# EAGLE schematic kytkentäkaavio (EAGLE 9.7.0)
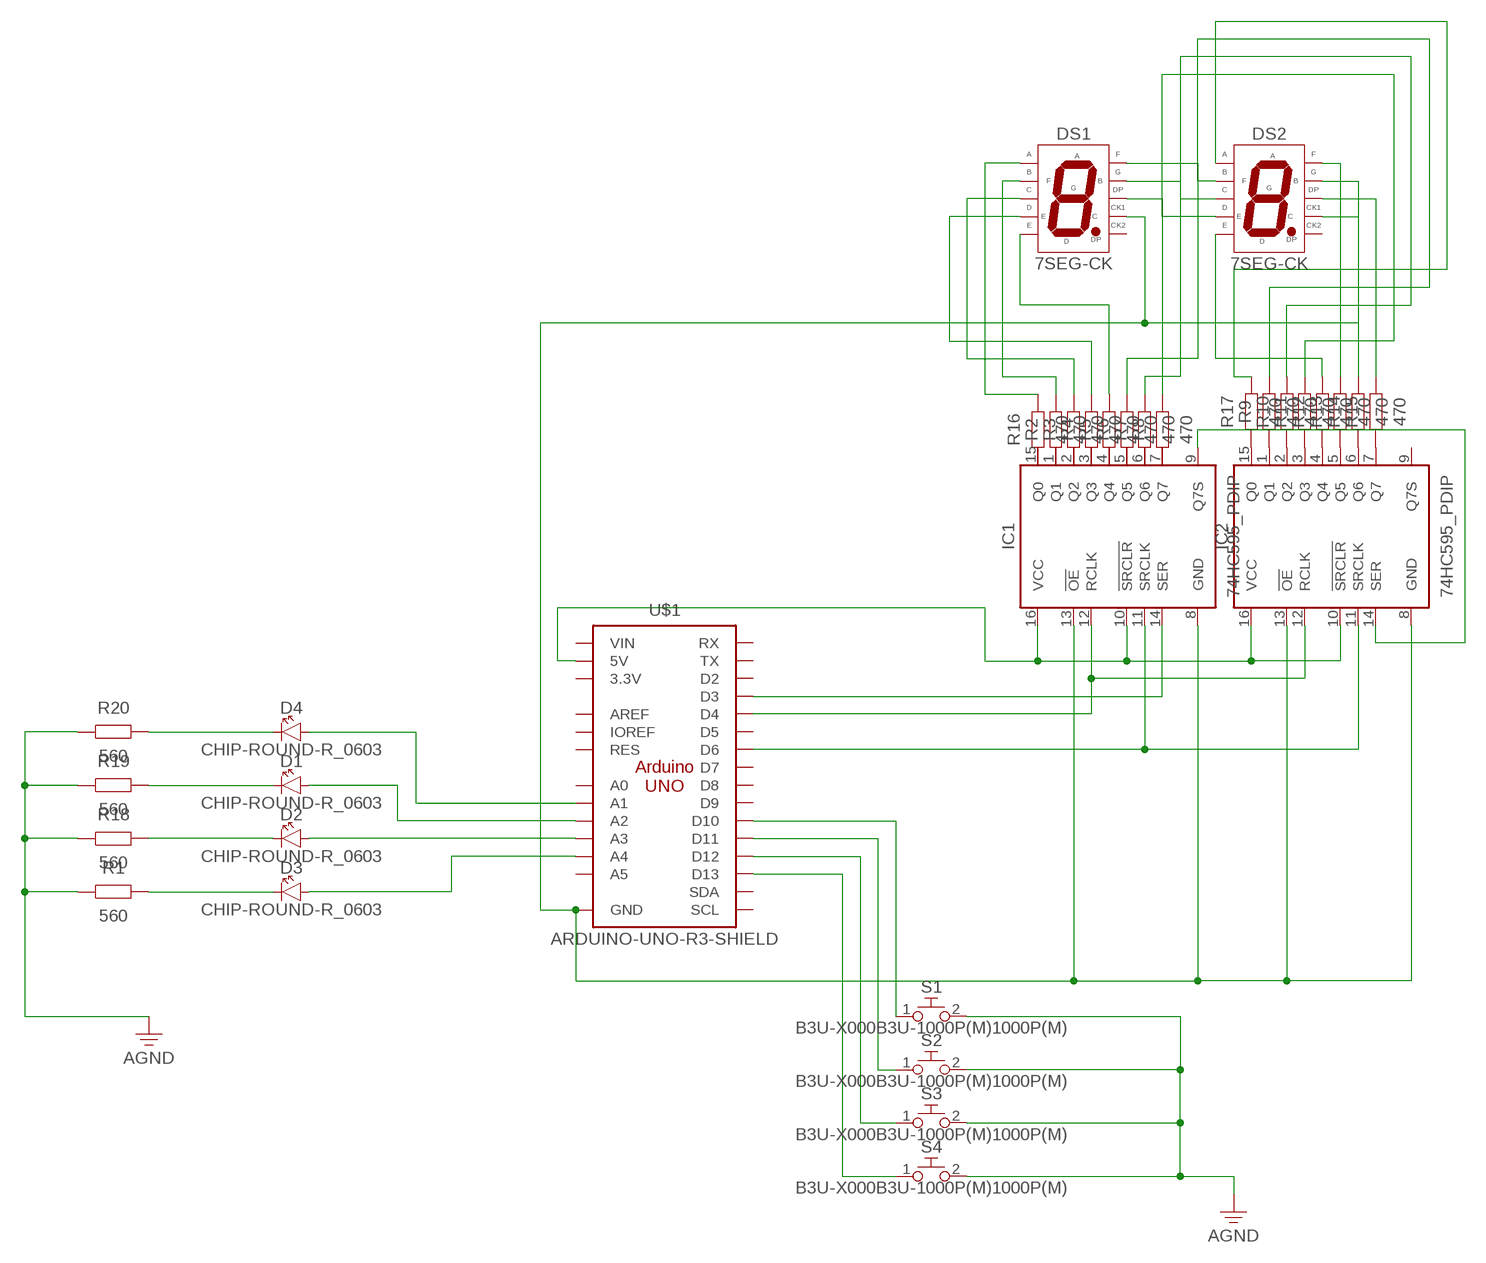
[diagram p0: schematic, sheet 1]

## Parts
D1  CHIP-ROUND-R_0603  [LEDC1608X65N_RND-R]
D2  CHIP-ROUND-R_0603  [LEDC1608X65N_RND-R]
D3  CHIP-ROUND-R_0603  [LEDC1608X65N_RND-R]
D4  CHIP-ROUND-R_0603  [LEDC1608X65N_RND-R]
DS1  7SEG-CK  [7SEG-13]
DS2  7SEG-CK  [7SEG-13]
IC1  74HC595_PDIP  [DIP762W53P254L1969H508Q16B]
IC2  74HC595_PDIP  [DIP762W53P254L1969H508Q16B]
R1  560  R_CHIP-0402(1005-METRIC)  [RESC1005X40]
R2  470  R_CHIP-0402(1005-METRIC)  [RESC1005X40]
R3  470  R_CHIP-0402(1005-METRIC)  [RESC1005X40]
R4  470  R_CHIP-0402(1005-METRIC)  [RESC1005X40]
R5  470  R_CHIP-0402(1005-METRIC)  [RESC1005X40]
R6  470  R_CHIP-0402(1005-METRIC)  [RESC1005X40]
R7  470  R_CHIP-0402(1005-METRIC)  [RESC1005X40]
R8  470  R_CHIP-0402(1005-METRIC)  [RESC1005X40]
R9  470  R_CHIP-0402(1005-METRIC)  [RESC1005X40]
R10  470  R_CHIP-0402(1005-METRIC)  [RESC1005X40]
R11  470  R_CHIP-0402(1005-METRIC)  [RESC1005X40]
R12  470  R_CHIP-0402(1005-METRIC)  [RESC1005X40]
R13  470  R_CHIP-0402(1005-METRIC)  [RESC1005X40]
R14  470  R_CHIP-0402(1005-METRIC)  [RESC1005X40]
R15  470  R_CHIP-0402(1005-METRIC)  [RESC1005X40]
R16  470  R_CHIP-0402(1005-METRIC)  [RESC1005X40]
R17  470  R_CHIP-0402(1005-METRIC)  [RESC1005X40]
R18  560  R_CHIP-0402(1005-METRIC)  [RESC1005X40]
R19  560  R_CHIP-0402(1005-METRIC)  [RESC1005X40]
R20  560  R_CHIP-0402(1005-METRIC)  [RESC1005X40]
S1  B3U-X000B3U-1000P(M)1000P(M)  [B3U-1000P(M)]
S2  B3U-X000B3U-1000P(M)1000P(M)  [B3U-1000P(M)]
S3  B3U-X000B3U-1000P(M)1000P(M)  [B3U-1000P(M)]
S4  B3U-X000B3U-1000P(M)1000P(M)  [B3U-1000P(M)]
U$1  ARDUINO-UNO-R3-SHIELD  [ARDUINO-UNO-R3-SHIELD]

## Nets
AGND: R1.1 R18.1 R19.1 R20.1 S1.2 S2.2 S3.2 S4.2
N$1: S4.1 U$1.D13
N$2: S3.1 U$1.D12
N$3: S2.1 U$1.D11
N$4: S1.1 U$1.D10
N$5: D3.A U$1.A4
N$6: D2.A U$1.A3
N$7: D1.A U$1.A2
N$8: D4.A U$1.A1
N$9: D1.C R19.2
N$10: IC2.1(Q1) R9.1
N$11: IC2.2(Q2) R10.1
N$12: IC2.3(Q3) R11.1
N$13: IC2.4(Q4) R12.1
N$14: IC2.5(Q5) R13.1
N$15: IC2.6(Q6) R14.1
N$16: IC2.7(Q7) R15.1
N$17: IC2.15(Q0) R17.1
N$18: DS1.3(CK1) DS2.3(CK1) IC1.8(GND) IC1.13(!OE) IC2.8(GND) IC2.13(!OE) U$1.GND@0(GND) U$1.GND@1(GND) U$1.GND@2(GND)
N$19: DS1.7(A) R16.2
N$20: DS1.6(B) R2.2
N$21: DS1.4(C) R3.2
N$22: DS1.2(D) R4.2
N$23: DS1.1(E) R5.2
N$24: DS1.5(DP) R8.2
N$25: DS1.10(G) R7.2
N$26: DS1.9(F) R6.2
N$27: DS2.7(A) R17.2
N$28: DS2.6(B) R9.2
N$29: DS2.4(C) R10.2
N$30: DS2.2(D) R11.2
N$31: DS2.1(E) R12.2
N$32: DS2.5(DP) R15.2
N$33: DS2.10(G) R14.2
N$34: DS2.9(F) R13.2
N$35: IC1.14(SER) U$1.D3
N$36: IC1.11(SRCLK) IC2.11(SRCLK) U$1.D6
N$37: IC1.12(RCLK) IC2.12(RCLK) U$1.D4
N$38: IC1.10(!SRCLR) IC1.16(VCC) IC2.10(!SRCLR) IC2.16(VCC) U$1.5V
N$39: IC1.9(Q7S) IC2.14(SER)
N$40: D3.C R1.2
N$41: D2.C R18.2
N$42: D4.C R20.2
Unconnected: DS1.8(CK2) DS2.8(CK2) IC1.1(Q1) IC1.2(Q2) IC1.3(Q3) IC1.4(Q4) IC1.5(Q5) IC1.6(Q6) IC1.7(Q7) IC1.15(Q0) IC2.9(Q7S) R2.1 R3.1 R4.1 R5.1 R6.1 R7.1 R8.1 R16.1 U$1.3.3V U$1.A0 U$1.A5 U$1.AREF U$1.D2 U$1.D5 U$1.D7 U$1.D8 U$1.D9 U$1.IOREF U$1.RES U$1.RX U$1.SCL U$1.SDA U$1.TX U$1.VIN

## Library data of the parts
D1-D4 = LED:CHIP-ROUND-R: Red LED - Generic; CATEGORY: LED; COLOR: Red; DESCRIPTION: Red LED Indication 0603 (1608 Metric); PACKAGE_SIZE: 0603; PACKAGE_TYPE: Surface Mount; SUBCATEGORY: Chip LED; TYPE: Square with Domed Top
DS1 DS2 = Opto-Electronic:7SEG-CK: 7-segment Display Common Cathode 13 mm; CATEGORY: Optoelectronics; COLOR: Red; DESCRIPTION: Single Digit Common Cathode LED Display 13 mm Digit Hight 15.24 mm Pitch; PACKAGE_SIZE: 10-DIP; PACKAGE_TYPE: Through Hole; SUBCATEGORY: LED Character and Numeric; TYPE: 7-Segment
IC1 IC2 = Tinkercad:74HC595: 8-Bit Shift Registers Reference Datasheet <https://www.ti.com/lit/ds/symlink/sn74hc595.pdf?ts=1637559852861&ref_url=https%253A%252F%252Fwww.google.com%252F>
R1-R20 = Resistor:R: Resistor Fixed - Generic; CATEGORY: Resistors; DESCRIPTION: Chip Resistor 1.05 X 0.54 X 0.40 mm body 0402(1005-METRIC) Package; PACKAGE_SIZE: 0402; PACKAGE_TYPE: Surface Mount
S1-S4 = Switch:B3U-X000: Ultra-small Tactile Switch Contact form : SPST-NO Reference: Datasheet <https://omronfs.omron.com/en_US/ecb/products/pdf/en-b3u.pdf>; CATEGORY: Switches; DATASHEET: https://omronfs.omron.com/en_US/ecb/products/pdf/en-b3u.pdf; DESCRIPTION: Tactile Switch SPST-NO Top Actuated Surface Mount; MANUFACTURER: Omron Electronics Inc-EMC Div; MPN: B3U-1000PM; OPERATING_TEMPERATURE: -25°C ~ 70°C; PACKAGE_SIZE: NA; PACKAGE_TYPE: SMD; PART_STATUS: ACTIVE; ROHS: COMPLIANT; SERIES: B3U; SUBCATEGORY: Tactile Switches; TYPE: SPST-NO
U$1 = Tinkercad:ARDUINO-UNO-R3-SHIELD